# EAGLE design 118_hall (EAGLE 8.1.0)
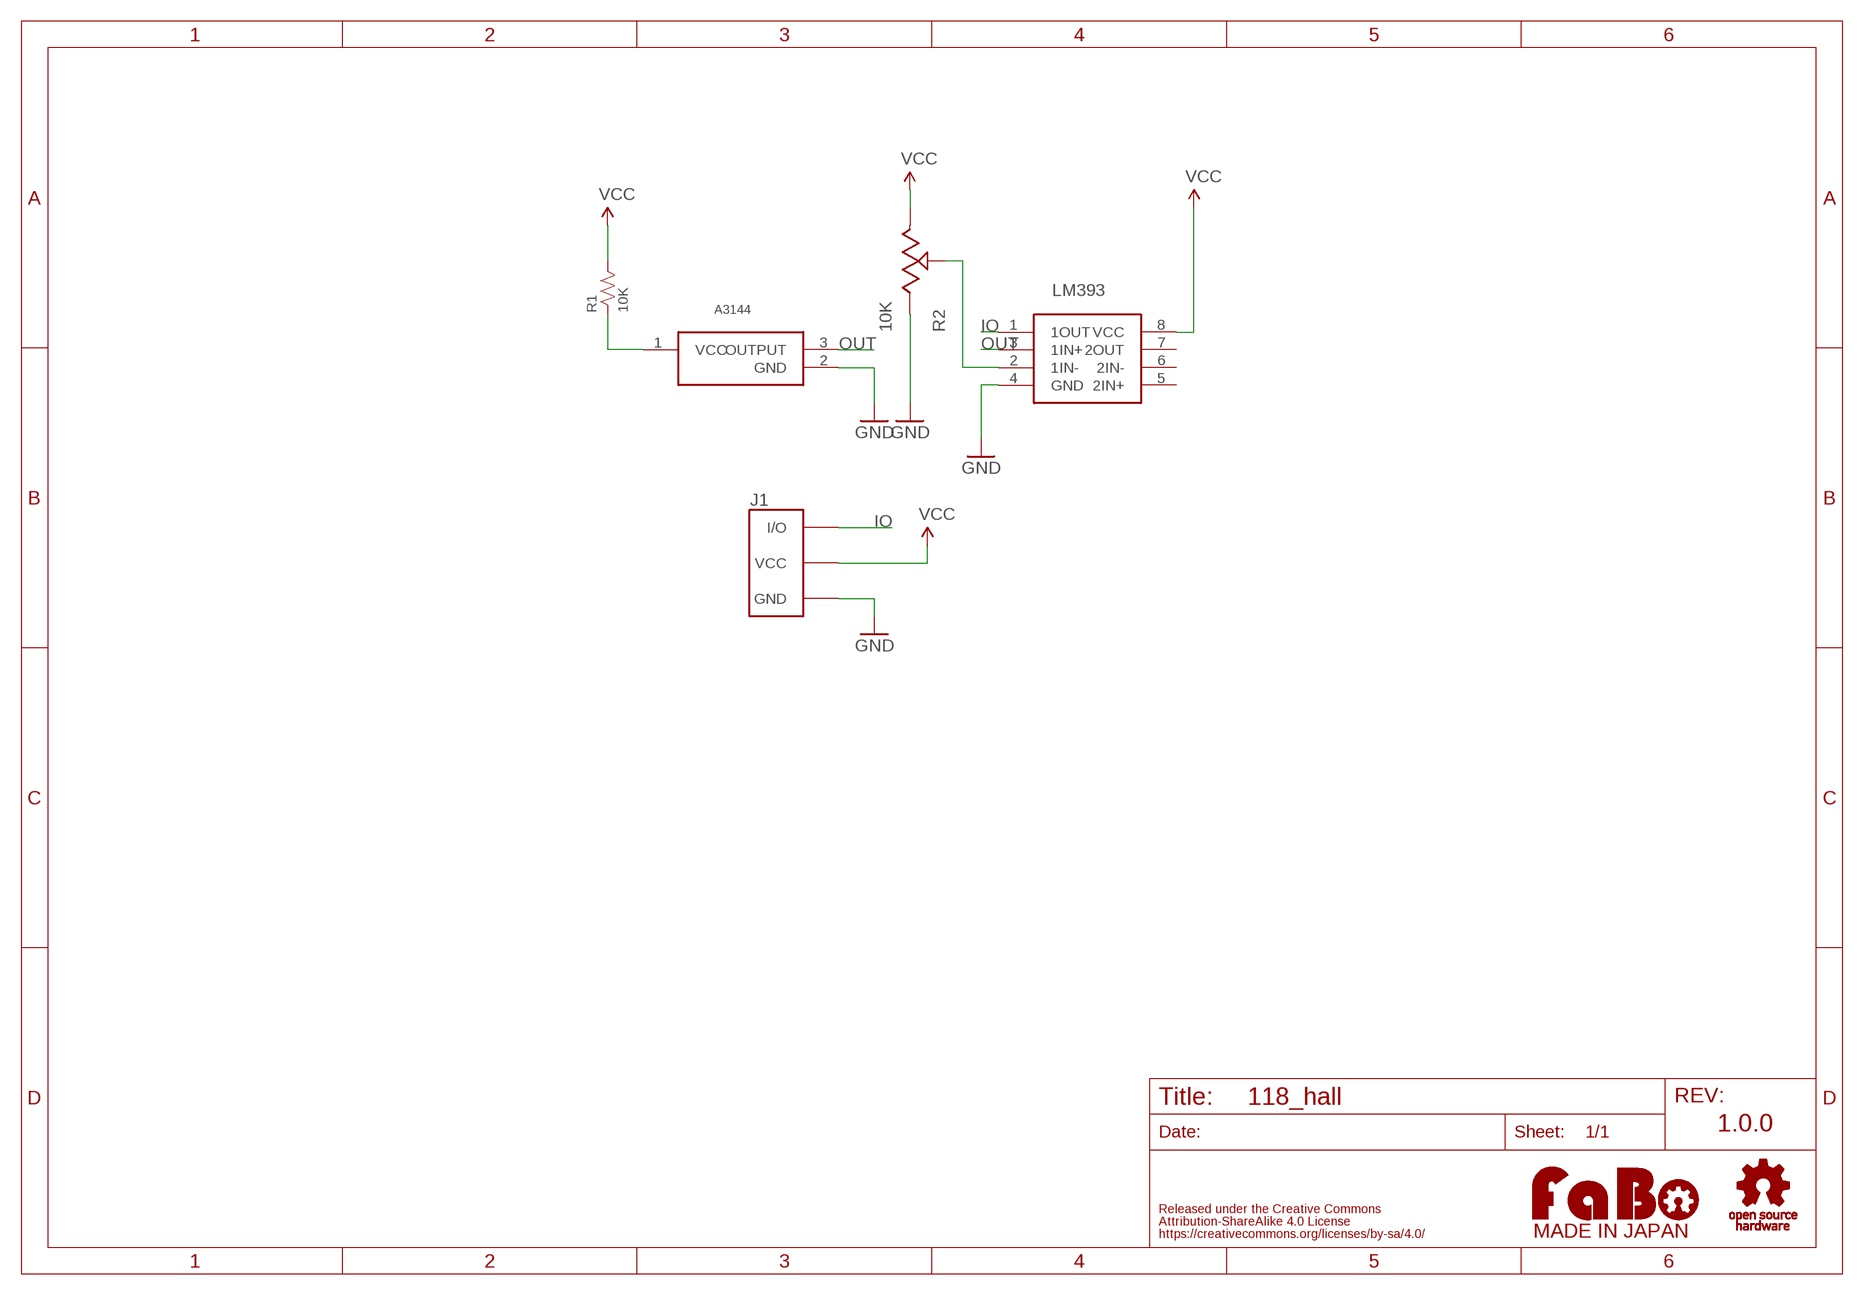
[diagram p0: schematic, sheet 1]

## Parts
A3144  A3144  [SOT-89]
J1  FABO_BRICK_3PIN  [FABO_BRICK_3PIN]
LM393  LM393  [SOIC(NARROW)-8]
R1  10K  RESISTOR-0603  [0603]
R2  10K  RESISTOR_VARIABLE-SMD  [TC33X]
U$2  LOGO_OSHW-M_BOTTOM  [LOGO_OSHW_M_BOTTOM]
U$4  LOGO_FABO-M  [LOGO_FABO_MS]

## Nets
GND: A3144.2(GND) J1.GND LM393.4(GND) R2.3
IO: J1.I/O LM393.1(1OUT)
N$1: LM393.2(1IN-) R2.2
N$3: A3144.1(VCC) R1.1
OUT: A3144.3(OUTPUT) LM393.3(1IN+)
VCC: J1.VCC LM393.8(VCC) R1.2 R2.1
Unconnected: LM393.5(2IN+) LM393.6(2IN-) LM393.7(2OUT)

## Notes on the sheet
- 1.0.0

## Library data of the parts
A3144 = FaBo-Sensor:A3144
J1 = FaBo-Template:FABO_BRICK_3PIN: FaBo Brick 3pin
LM393 = FaBo-Opamp:LM393
R1 = FaBo-Resistors:RESISTOR: RESISTOR
R2 = FaBo-Resistors:RESISTOR_VARIABLE
U$2 = FaBo-etc:LOGO_OSHW
U$4 = FaBo-etc:LOGO_FABO

## Board
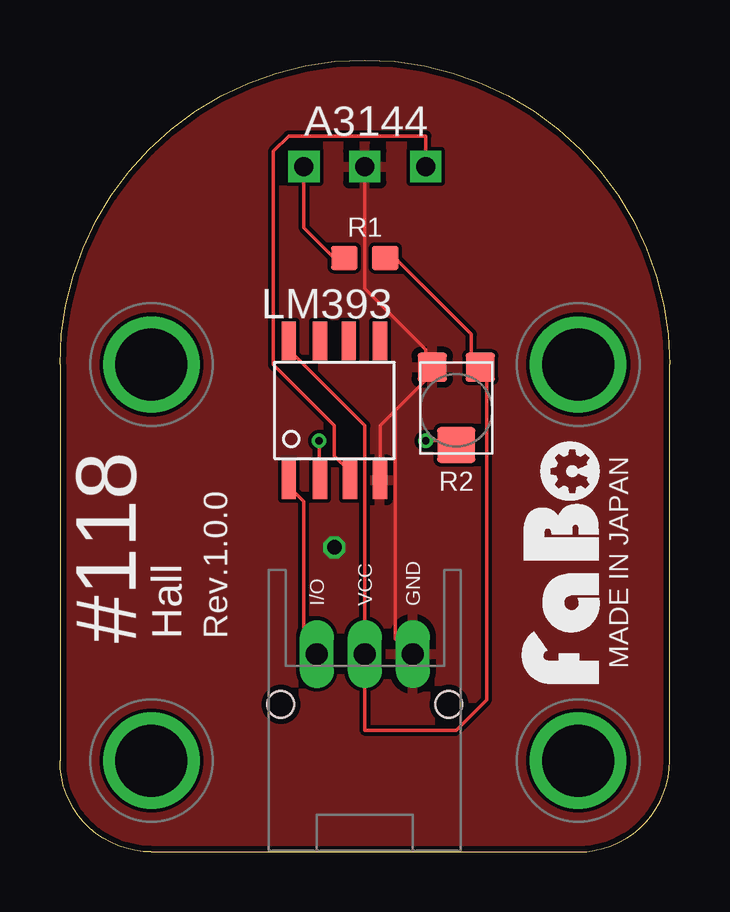
[diagram p1: board, top side]
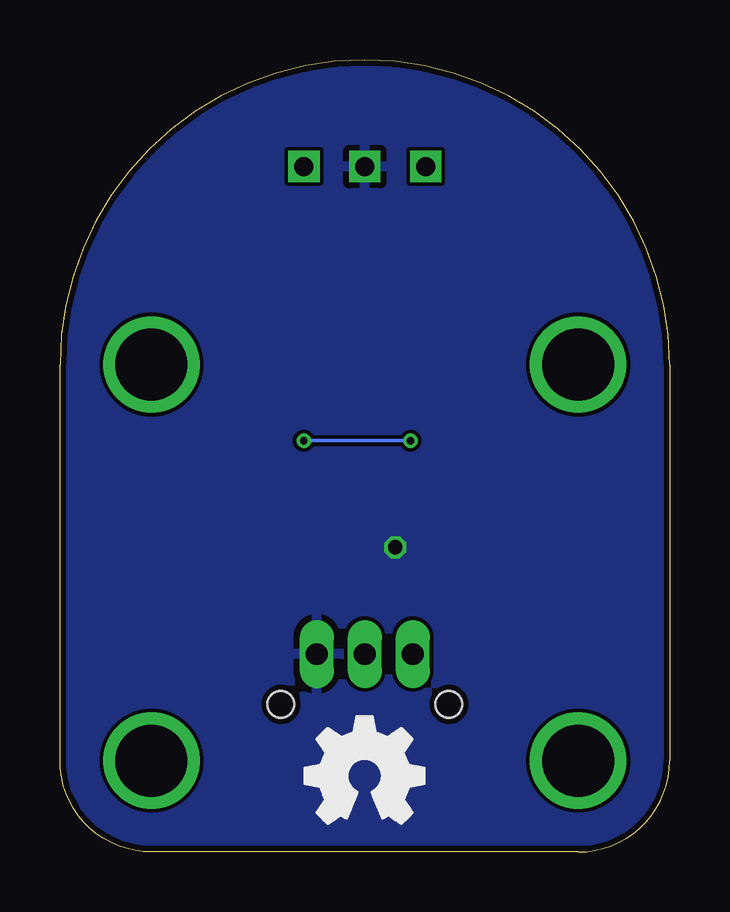
[diagram p2: board, bottom side, seen from below]

Size 25.4 x 33.02 mm. Coordinates in mm from the lower left corner, seen from the top.
Copper layers (1*16): Top 0.035mm / dielectric 1.5mm / Bottom 0.035mm
Design rules "SeeedStudio_2layer_DRU_no_angle_20140221": minimum track width 6mil, minimum drill 12mil, track to track 6mil, track to pad 6mil, pad to pad 6mil, via to via 6mil, smd to smd 0mil, copper to edge 10mil, drill to drill 10mil, minimum pad ring 10mil, minimum via ring 6mil, stop-mask expansion 2mil, vias tented up to drill 100mil, thermal gap 10mil

### Footprints (pad centres in the part's own frame; a part is rotated, then mirrored left to right if it is on the bottom)
SOT-89 = drill 0.8 square: 1 -2.54,0; 2 0,0; 3 2.54,0
FABO_BRICK_3PIN = drill 0.9 pad 1.422 long: GND 2,-8.255; I/O -2,-8.255; VCC 0,-8.255 | drill 3 pad 3.81: P$1 -8.89,3.81; P$2 8.89,3.81; P$3 -8.89,-12.7; P$4 8.89,-12.7 | hole 1.1: -3.5,-10.355; 3.5,-10.355
SOIC(NARROW)-8 = smd 0.6 x 1.6: 1 -1.9,-2.9; 2 -0.6,-2.9; 3 0.66,-2.9; 4 1.9,-2.9; 5 1.9,2.9; 6 0.6,2.9; 7 -0.6,2.9; 8 -1.9,2.9
0603 = smd 1.1 x 1: 1 -0.85,0; 2 0.85,0
TC33X = smd 1.2 x 1.2: 1 -1,-1.8; 3 1,-1.8 | smd 1.6 x 1.5: 2 0,1.45

### Placement (x,y rotation side)
A3144  12.7,28.57 0 top
J1  12.7,16.51 0 top
LM393  11.43,18.41 0 top
R1  12.7,24.77 0 top
R2  16.51,18.41 180 top
U$2  12.7,3.17 0 top
U$4  22.86,12.06 90 top

### Tracks (layer width: path | path; a pad name or v marks a point on that pad's centre or on a via)
GND  (via drill 0.6)
  Top 0.152: 13.97,18.41 13.34,17.78 13.34,15.88 LM393.4 | 13.97,18.41 15.24,19.68 R2.3 15.24,20.32 15.24,20.95 12.7,23.5 A3144.2 | 13.97,18.41 13.97,8.89 14.61,8.26 J1.GND
  other vias: 11.43,12.7
  pour Bottom: 0,0 25.4,0 25.4,33.02 0,33.02
  pour Top: 0,0 25.4,0 25.4,33.02 0,33.02
IO
  Top 0.152: LM393.1 9.53,15.24 10.16,14.61 10.16,8.26 J1.I/O
N$1  (via drill 0.3)
  Top 0.152: v10.79,17.14 10.79,15.88 LM393.2 | v15.24,17.14 16.51,17.14 R2.2
  Bottom 0.152: v15.24,17.14 v10.79,17.14
N$3
  Top 0.152: A3144.1 10.16,26.04 11.43,24.77 R1.1
OUT
  Top 0.152: A3144.3 15.24,29.84 9.53,29.84 8.89,29.21 8.89,20.32 11.43,17.78 11.43,16.51 12.06,15.88 LM393.3
VCC
  Top 0.152: R1.2 13.97,24.77 17.14,21.59 17.14,20.32 R2.1 17.78,19.68 17.78,6.35 16.51,5.08 12.7,5.08 J1.VCC 12.7,17.78 9.53,20.95 LM393.8

### Text on the board
tPlace: #118 | MADE IN JAPAN | Hall | Rev.1.0.0